# Altium schematic sheet Volume.SchDoc
size A4
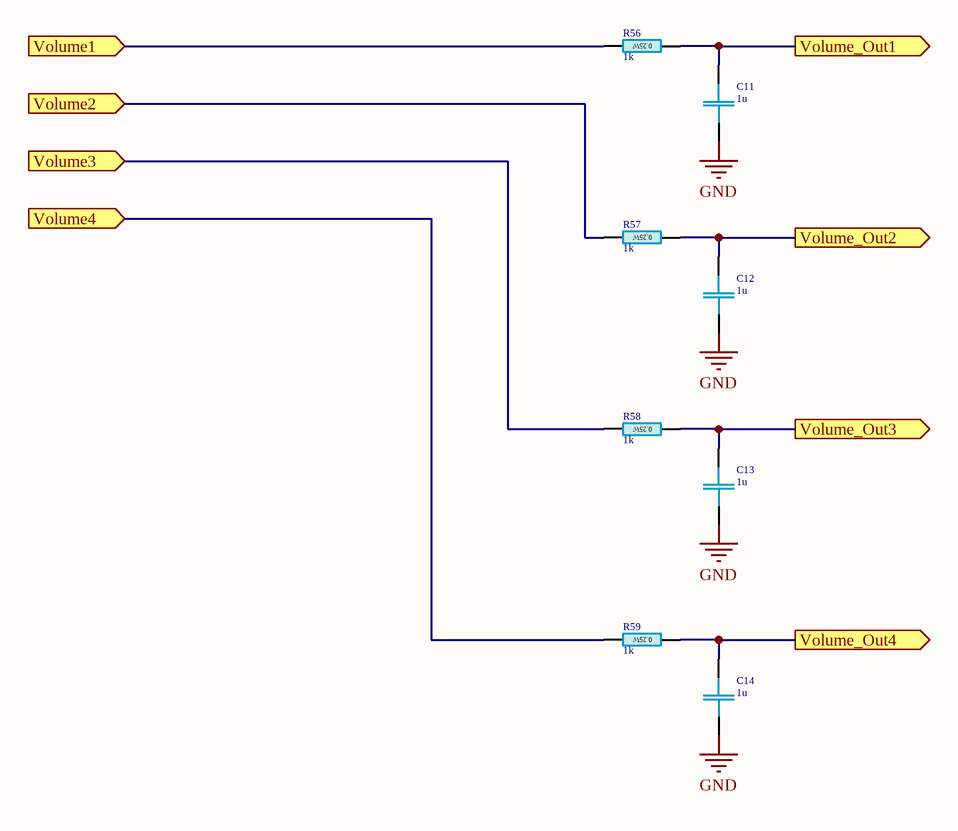
[diagram p0: Volume.SchDoc]

## Parts
C11  1u  [C1206]
C12  1u  [C1206]
C13  1u  [C1206]
C14  1u  [C1206]
R56  1k  [R1206]
R57  1k  [R1206]
R58  1k  [R1206]
R59  1k  [R1206]

## Ports
Volume1 (in), Volume2 (in), Volume3 (in), Volume4 (in), Volume_Out1 (out), Volume_Out2 (out), Volume_Out3 (out), Volume_Out4 (out)

## Nets
GND: C11.2 C12.2 C13.2 C14.2
Volume1: R56.2 ; port Volume1
Volume2: R57.2 ; port Volume2
Volume3: R58.2 ; port Volume3
Volume4: R59.2 ; port Volume4
Volume_Out1: C11.1 R56.1 ; port Volume_Out1
Volume_Out2: C12.1 R57.1 ; port Volume_Out2
Volume_Out3: C13.1 R58.1 ; port Volume_Out3
Volume_Out4: C14.1 R59.1 ; port Volume_Out4

## Library data of the parts
C11-C14 = C 1206  100V X7R - 100n: SMD 1206   100V X7R 10%; Part Number: CL31B104KCFNNNE; Manufacturer: Samsung; TYPE: Capacitors; Package-mm: 3216; Mount Type: SMT; Publisher: Hefest; Manufacturer Alternate: *; Part Number Alternate: *; Published: 07.04.2019; Supplier 1: Comet; Supplier Part Number 1: C1206 100nF 100V X7R SAMSUNG; RoHS: Y; Technology: Ceramic  MLCC; Package: 1206; VDC: 100V; TempCo: X7R; Tolerance %: ±10%; VAC: *; ESR Ohm: *; ComponentLink1Description: Datasheet Link; ComponentLink1URL: https://store.comet.bg/download-file.php?id=11; Temperature Range: -55°C ~ +125°C; Price: 0.090; ComponentLink2Description: Characteristics data; ComponentLink2URL: https://store.comet.bg/download-file.php?id=3821; Value: 1u
R56-R59 = R 1206-5%: SMD 1206 0.25W   5% 200V; Manufacturer: YAGEO; TempCo: ±100ppm/°C; Package-mm: 3216; Value Code: 102; Part Number: *; Mount Type: SMT; Publisher: Hefest; Manufacturer Alternate: *; Published: 07.04.2019; Supplier 1: Comet; Supplier Part Number 1: R1206 1.0K 5% YAG/ASJ; RoHS: Y; Technology: Thick film; Package: 1206; VDC: 200V; Tolerance %: ±5%; ComponentLink1Description: Datasheet Link; ComponentLink1URL: https://store.comet.bg/download-file.php?id=140; Temperature Range: -55°C ~ +155°C; Price: 0.054; Part Number Alternate: *; TYPE: Resistor; Power: 0.25W; Value: 1k